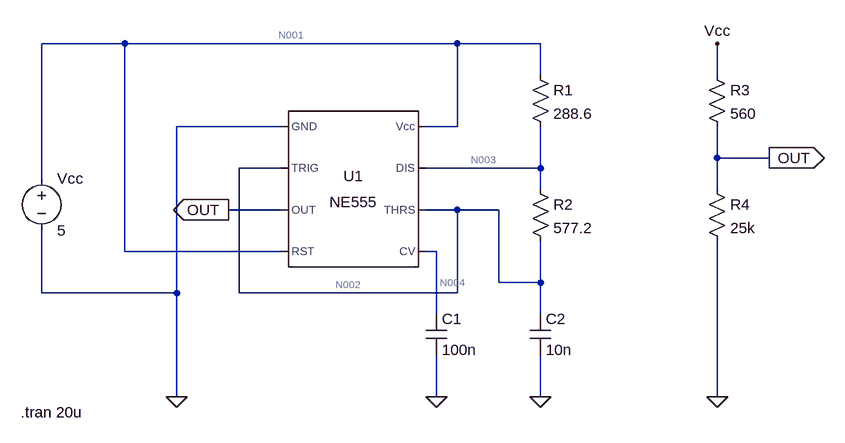
[diagram p0: schematic 555Timer.asc]
555Timer.asc, the LTspice schematic file:
Version 4
SHEET 1 916 680
WIRE -304 -16 -432 -16
WIRE 208 -16 -304 -16
WIRE 336 -16 208 -16
WIRE 336 32 336 -16
WIRE 608 32 608 -16
WIRE -64 112 -224 112
WIRE 208 112 208 -16
WIRE 208 112 160 112
WIRE 608 160 608 112
WIRE 688 160 608 160
WIRE -64 176 -128 176
WIRE 336 176 336 112
WIRE 336 176 160 176
WIRE -432 192 -432 -16
WIRE 336 208 336 176
WIRE 608 208 608 160
WIRE -64 240 -144 240
WIRE 208 240 160 240
WIRE 272 240 208 240
WIRE -304 304 -304 -16
WIRE -64 304 -304 304
WIRE 176 304 160 304
WIRE 272 352 272 240
WIRE 336 352 336 288
WIRE 336 352 272 352
WIRE -432 368 -432 272
WIRE -224 368 -224 112
WIRE -224 368 -432 368
WIRE -128 368 -128 176
WIRE 208 368 208 240
WIRE 208 368 -128 368
WIRE 176 400 176 304
WIRE 336 400 336 352
WIRE -224 528 -224 368
WIRE 176 528 176 464
WIRE 336 528 336 464
WIRE 608 528 608 288
FLAG -224 528 0
FLAG 176 528 0
FLAG 336 528 0
FLAG -144 240 OUT
IOPIN -144 240 Out
FLAG 688 160 OUT
IOPIN 688 160 Out
FLAG 608 528 0
FLAG 608 -16 Vcc
SYMBOL Misc\\NE555 48 208 R0
SYMATTR InstName U1
SYMBOL voltage -432 176 R0
WINDOW 123 0 0 Left 2
WINDOW 39 0 0 Left 2
SYMATTR InstName Vcc
SYMATTR Value 5
SYMBOL res 320 16 R0
SYMATTR InstName R1
SYMATTR Value 288.6
SYMBOL res 320 192 R0
SYMATTR InstName R2
SYMATTR Value 577.2
SYMBOL cap 160 400 R0
SYMATTR InstName C1
SYMATTR Value 100n
SYMBOL cap 320 400 R0
SYMATTR InstName C2
SYMATTR Value 10n
SYMBOL res 592 16 R0
SYMATTR InstName R3
SYMATTR Value 560
SYMBOL res 592 192 R0
SYMATTR InstName R4
SYMATTR Value 25k
TEXT -464 552 Left 2 !.tran 20u

The netlist it stands for:
* 555Timer.asc
XU1 0 N002 OUT N001 N004 N002 N003 N001 NE555  ; pins GND TRIG OUT RST CV THRS DIS Vcc
Vcc N001 0 5
R1 N001 N003 288.6
R2 N003 N002 577.2
C1 N004 0 100n
C2 N002 0 10n
R3 Vcc OUT 560
R4 OUT 0 25k
.tran 20u
.lib NE555.sub
.backanno
.end

* Results of the author's LTspice run, read from the files saved beside the schematic
* Operating Point, zero values left out:
*   V(n002) = 5 V
*   V(n004) = 3.333 V
*   V(n001) = 5 V
*   V(n003) = 5 V
*   V(out) = 4.999 V
*   V(vcc) = 4.999 V
*   I(R4) = 200 µA
*   I(R2) = 10 nA
*   I(R1) = 16.67 nA
*   I(Vcc) = -1.811 mA
*   Ix(u1:1) = -1.611 mA
*   Ix(u1:2) = 5 nA
*   Ix(u1:3) = -200 µA
*   Ix(u1:4) = 22.67 µA
*   Ix(u1:6) = 5 nA
*   Ix(u1:7) = 6.672 nA
*   Ix(u1:8) = 1.788 mA
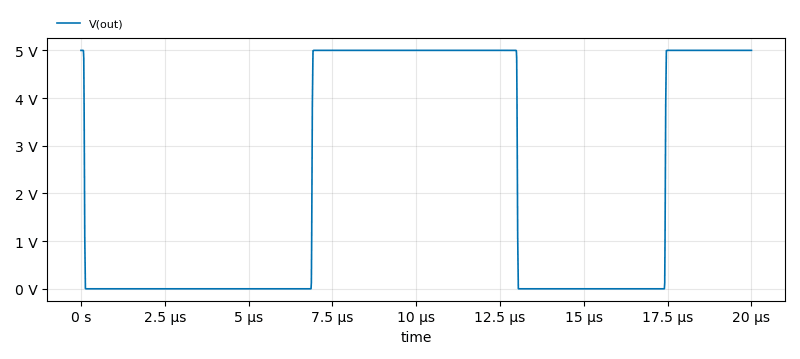
[diagram p1: Transient Analysis of 555Timer.asc, plotted from the saved traces]
* Transient Analysis, 1 run:
*   V(out): min 29.99 µV, max 4.999 V, average 2.198 V, rms 3.31 V, last 4.999 V